# Altium schematic sheet Holoboard_power_supply.SchDoc
size A4
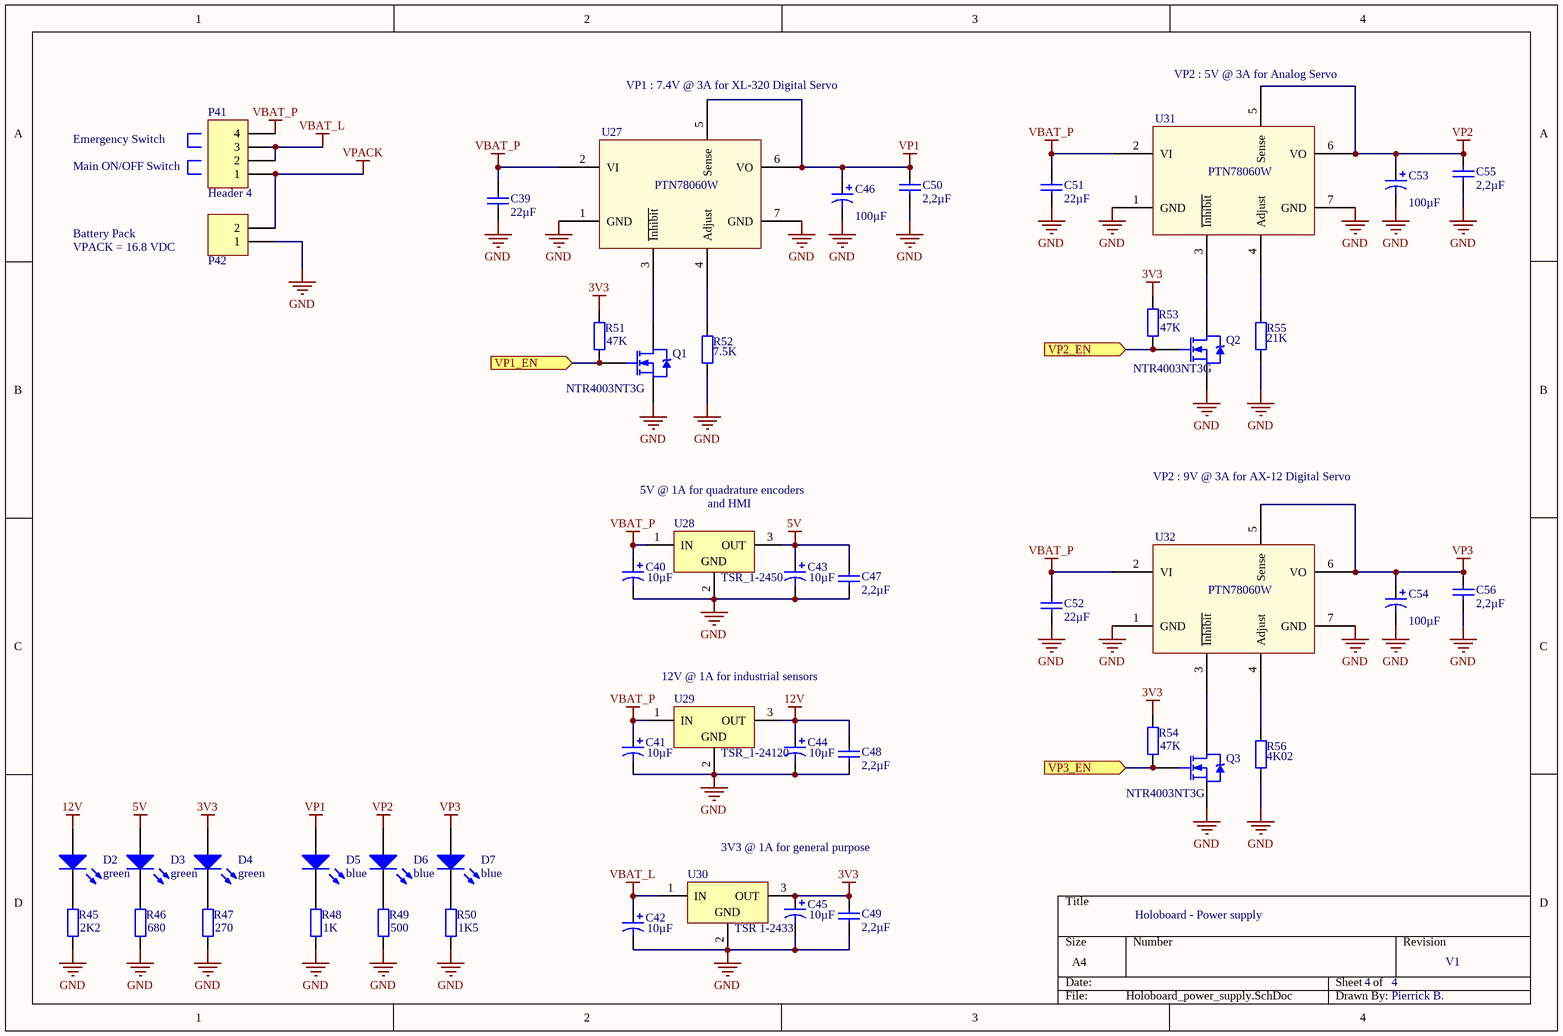
[diagram p0: Holoboard_power_supply.SchDoc]

## Parts
C39  value 22µF  [Boitier tantale B]  (hidden comment: Cap)
C40  value 10µF  [Boitier tantale B]  (hidden comment: Cap Pol)
C41  value 10µF  [Boitier tantale B]  (hidden comment: Cap Pol)
C42  value 10µF  [Boitier tantale B]  (hidden comment: Cap Pol)
C43  value 10µF  [Boitier tantale B]  (hidden comment: Cap Pol)
C44  value 10µF  [Boitier tantale B]  (hidden comment: Cap Pol)
C45  value 10µF  [Boitier tantale B]  (hidden comment: Cap Pol)
C46  value 100µF  [Boitier tantale C]  (hidden comment: Cap Pol)
C47  value 2,2µF  [C0805]  (hidden comment: Cap)
C48  value 2,2µF  [C0805]  (hidden comment: Cap)
C49  value 2,2µF  [C0805]  (hidden comment: Cap)
C50  value 2,2µF  [C0805]  (hidden comment: Cap)
C51  value 22µF  [Boitier tantale B]  (hidden comment: Cap)
C52  value 22µF  [Boitier tantale B]  (hidden comment: Cap)
C53  value 100µF  [Boitier tantale C]  (hidden comment: Cap Pol)
C54  value 100µF  [Boitier tantale C]  (hidden comment: Cap Pol)
C55  value 2,2µF  [C0805]  (hidden comment: Cap)
C56  value 2,2µF  [C0805]  (hidden comment: Cap)
D2  green  [KP-2012]
D3  green  [KP-2012]
D4  green  [KP-2012]
D5  blue  [KP-2012]
D6  blue  [KP-2012]
D7  blue  [KP-2012]
P41  Header 4  [IMO - 20.155MH/4]
P42  Header 2  [IMO - 20.155MH/2]  (value not drawn)
Q1  NTR4003NT3G  [SOT-23]
Q2  NTR4003NT3G  [SOT-23]
Q3  NTR4003NT3G  [SOT-23]
R45  value 2K2  [0603]  (hidden comment: Res2)
R46  value 680  [0603]  (hidden comment: Res2)
R47  value 270  [0603]  (hidden comment: Res2)
R48  value 1K  [0603]  (hidden comment: Res2)
R49  value 500  [0603]  (hidden comment: Res2)
R50  value 1K5  [0603]  (hidden comment: Res2)
R51  value 47K  [0603]  (hidden comment: Res2)
R52  value 7.5K  [0603]  (hidden comment: Res2)
R53  value 47K  [0603]  (hidden comment: Res2)
R54  value 47K  [0603]  (hidden comment: Res2)
R55  value 21K  [0603]  (hidden comment: Res2)
R56  value 4K02  [0603]  (hidden comment: Res2)
U27  PTN78060W  [EUW]
U28  TSR_1-2450  [TSR-1]
U29  TSR_1-24120  [TSR-1]
U30  TSR 1-2433  [TSR-1]
U31  PTN78060W  [EUW]
U32  PTN78060W  [EUW]

## Ports
VP1_EN (in), VP2_EN (in), VP3_EN (in)

## Nets
3V3: C45.1 C49.2 D4.1(A) R51.2 R53.2 R54.2 U30.3(OUT)
5V: C43.1 C47.2 D3.1(A) U28.3(OUT)
12V: C44.1 C48.2 D2.1(A) U29.3(OUT)
GND: C39.1 C40.2 C41.2 C42.2 C43.2 C44.2 C45.2 C46.2 C47.1 C48.1 C49.1 C50.1 C51.1 C52.1 C53.2 C54.2 C55.1 C56.1 P42.1 Q1.2(S) Q2.2(S) Q3.2(S) R45.1 R46.1 R47.1 R48.1 R49.1 R50.1 R52.1 R55.1 R56.1 U27.1(GND) U27.7(GND) U28.2(GND) U29.2(GND) U30.2(GND) U31.1(GND) U31.7(GND) U32.1(GND) U32.7(GND)
VBAT_L: C42.1 P41.2 P41.3 U30.1(IN)
VBAT_P: C39.2 C40.1 C41.1 C51.2 C52.2 P41.4 U27.2(VI) U28.1(IN) U29.1(IN) U31.2(VI) U32.2(VI)
VP1: C46.1 C50.2 D5.1(A) U27.5(Sense) U27.6(VO)
VP2: C53.1 C55.2 D6.1(A) U31.5(Sense) U31.6(VO)
VP3: C54.1 C56.2 D7.1(A) U32.5(Sense) U32.6(VO)
VPACK: P41.1 P42.2
VP1_EN: Q1.1(G) R51.1 ; port VP1_EN
VP2_EN: Q2.1(G) R53.1 ; port VP2_EN
VP3_EN: Q3.1(G) R54.1 ; port VP3_EN
NetD2_2: D2.2(K) R45.2
NetD3_2: D3.2(K) R46.2
NetD4_2: D4.2(K) R47.2
NetD5_2: D5.2(K) R48.2
NetD6_2: D6.2(K) R49.2
NetD7_2: D7.2(K) R50.2
NetQ1_3: Q1.3(D) U27.3(~{Inhibit})
NetQ2_3: Q2.3(D) U31.3(~{Inhibit})
NetQ3_3: Q3.3(D) U32.3(~{Inhibit})
NetR52_2: R52.2 U27.4(Adjust)
NetR55_2: R55.2 U31.4(Adjust)
NetR56_2: R56.2 U32.4(Adjust)

## Notes on the sheet
- (near U27) VP1 : 7.4V @ 3A for XL-320 Digital Servo
- (near U31) VP2 : 5V @ 3A for Analog Servo
- Emergency Switch
- Main ON/OFF Switch
- Battery Pack
- VPACK = 16.8 VDC
- 5V @ 1A for quadrature encoders
- (near U28) and HMI
- VP2 : 9V @ 3A for AX-12 Digital Servo
- (near U29) 12V @ 1A for industrial sensors
- 3V3 @ 1A for general purpose
- Holoboard - Power supply
- 4
- V1
- Pierrick B.

## Library data of the parts
C39 C47-C52 C55 C56 = Cap: Capacitor; Published: 8-Jun-2000; LatestRevisionDate: 17-Jul-2002; LatestRevisionNote: Re-released for DXP Platform.; PackageReference: RAD-0.3; Publisher: Altium Limited; Supplier: FARNELL
C40-C46 C53 C54 = Cap Pol: Polarized Capacitor; Published: 8-Jun-2000; LatestRevisionDate: 17-Jul-2002; LatestRevisionNote: Re-released for DXP Platform.; PackageReference: POLAR0.8; Publisher: Altium Limited; Supplier: FARNELL
D2-D7 = LED1: Typical RED GaAs LED; Published: 8-Jun-2000; LatestRevisionDate: 08-Jul-2005; LatestRevisionNote: Mech Layer 1 removed.; PackageReference: LED-1; Publisher: Altium Limited
P41 = Header 4: Header, 4-Pin; LatestRevisionDate: 17-Jul-2002; LatestRevisionNote: Re-released for DXP Platform.; Publisher: Altium Limited
P42 = Header 2: Header, 2-Pin; LatestRevisionDate: 17-Jul-2002; LatestRevisionNote: Re-released for DXP Platform.; Publisher: Altium Limited
Q1-Q3 = NMOS-2: N-Channel Power MOSFET; Note: Pin 2 is electrically connected to pin 4.; Published: 8-Jun-2000; LatestRevisionDate: 17-Jul-2002; LatestRevisionNote: Re-released for DXP Platform.; DatasheetDocument: PD-9.814; PackageReference: TO-220AB; Publisher: Altium Limited; Code_JEDEC: TO-220-AB; ComponentLink1Description: Manufacturer Link; ComponentLink1URL: http://www.irf.com/
R45-R56 = Res2: Resistor; Published: 8-Jun-2000; LatestRevisionDate: 17-Jul-2002; LatestRevisionNote: Re-released for DXP Platform.; PackageReference: AXIAL-0.4; Publisher: Altium Limited; Supplier: FARNELL